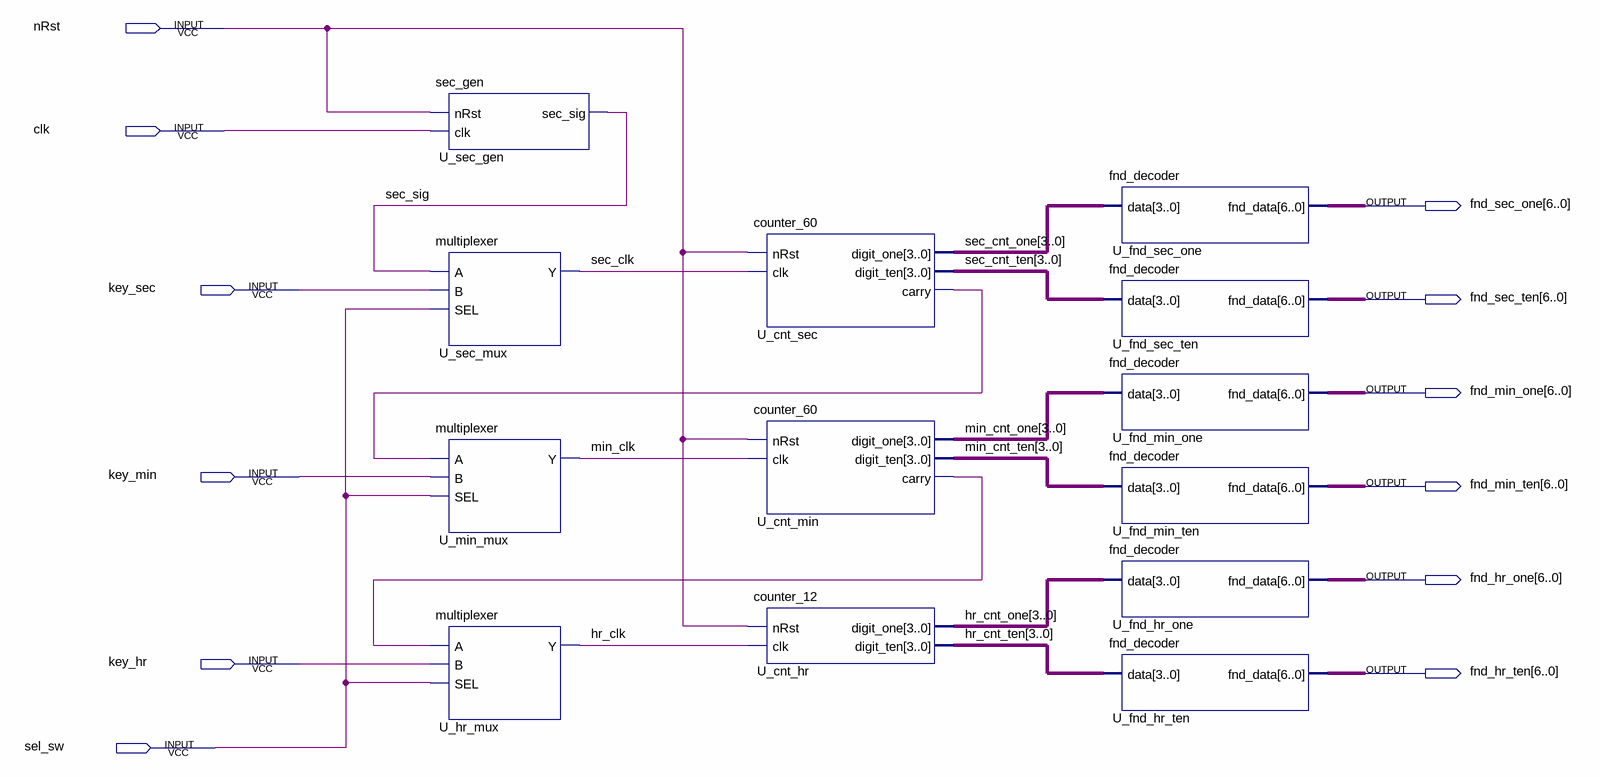
[diagram p0: schematic sheet]
// Quartus schematic digitalWatch.bdf as structural Verilog: 13 symbols, 12 pins
module digitalWatch (
  input  nRst,
  input  clk,
  input  key_sec,
  input  key_min,
  input  key_hr,
  input  sel_sw,
  output [6:0] fnd_sec_one,
  output [6:0] fnd_sec_ten,
  output [6:0] fnd_min_one,
  output [6:0] fnd_min_ten,
  output [6:0] fnd_hr_one,
  output [6:0] fnd_hr_ten
);

  wire hr_clk, min_clk, sec_clk, sec_sig, U_cnt_min_carry, U_cnt_sec_carry;
  wire [3:0] hr_cnt_one, hr_cnt_ten, min_cnt_one, min_cnt_ten, sec_cnt_one, sec_cnt_ten;

  sec_gen U_sec_gen (.nRst(nRst), .clk(clk), .sec_sig(sec_sig));
  multiplexer U_sec_mux (.A(sec_sig), .B(key_sec), .SEL(sel_sw), .Y(sec_clk));
  multiplexer U_min_mux (.A(U_cnt_sec_carry), .B(key_min), .SEL(sel_sw), .Y(min_clk));
  multiplexer U_hr_mux (.A(U_cnt_min_carry), .B(key_hr), .SEL(sel_sw), .Y(hr_clk));
  counter_60 U_cnt_sec (
    .nRst(nRst), .clk(sec_clk), .digit_one(sec_cnt_one), .digit_ten(sec_cnt_ten), .carry(U_cnt_sec_carry));
  counter_60 U_cnt_min (
    .nRst(nRst), .clk(min_clk), .digit_one(min_cnt_one), .digit_ten(min_cnt_ten), .carry(U_cnt_min_carry));
  counter_12 U_cnt_hr (.nRst(nRst), .clk(hr_clk), .digit_one(hr_cnt_one), .digit_ten(hr_cnt_ten));
  fnd_decoder U_fnd_sec_one (.data(sec_cnt_one), .fnd_data(fnd_sec_one));
  fnd_decoder U_fnd_sec_ten (.data(sec_cnt_ten), .fnd_data(fnd_sec_ten));
  fnd_decoder U_fnd_min_one (.data(min_cnt_one), .fnd_data(fnd_min_one));
  fnd_decoder U_fnd_min_ten (.data(min_cnt_ten), .fnd_data(fnd_min_ten));
  fnd_decoder U_fnd_hr_one (.data(hr_cnt_one), .fnd_data(fnd_hr_one));
  fnd_decoder U_fnd_hr_ten (.data(hr_cnt_ten), .fnd_data(fnd_hr_ten));
endmodule
